# Altium project Host_CAP_sensor.PrjPcb
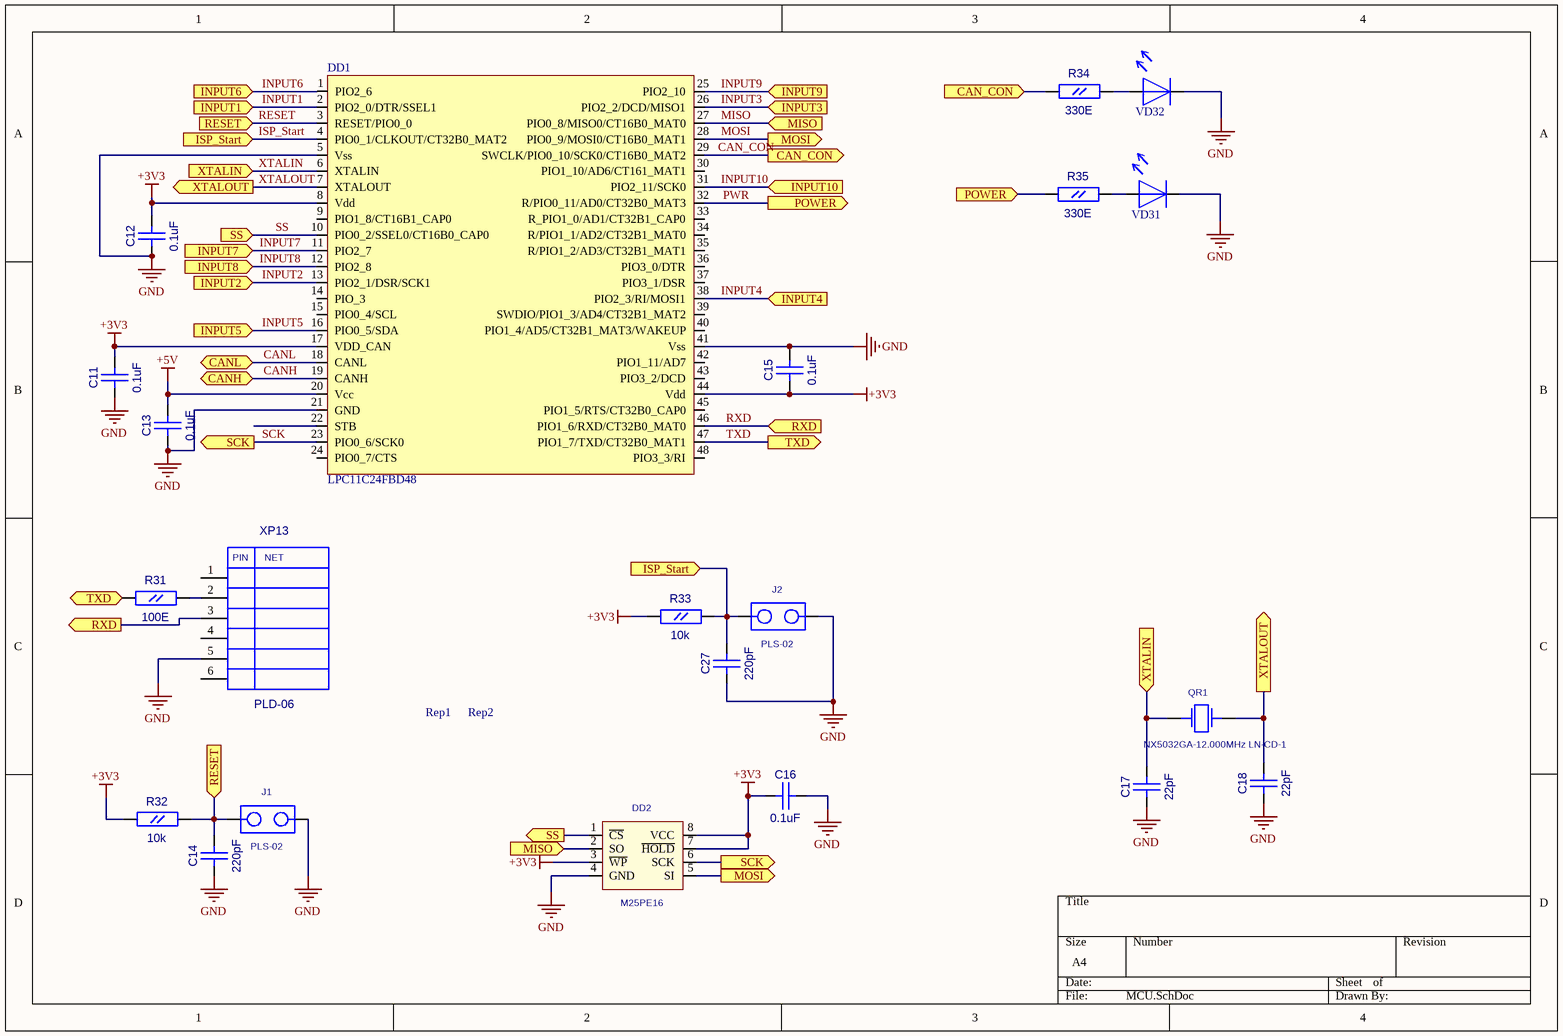
[diagram p0: MCU.SchDoc]
5 sheets, 162 parts. Net scope: flat (ports and power ports of the same name join across sheets).
Board file: cap_sensor_host.PcbDoc
Sheets:
  MCU.SchDoc
  Connectors.SchDoc
  LED_indication.SchDoc
  Power.SchDoc
  Input_scheme.SchDoc

## Sheet MCU.SchDoc
size A4

### Parts
(Parts that share a designator on the sheet are numbered #1, #2 ... from top to bottom, then left to right.)
C11  0.1uF  [CC0603]
C12  0.1uF  [CC0603]
C13  0.1uF  [CC0603]
C14  220pF  [CC0603]
C15  0.1uF  [CC0603]
C16  0.1uF  [CC0603]
C17  22pF  [CC0603]
C18  22pF  [CC0603]
C27  220pF  [CC0603]
DD1  LPC11C24FBD48  [LQFP-48]
DD2  M25PE16  [EIAJ_SO8]
J1  PLS-02  [PIN2W]
J2#1  PLS-02  [PIN2W]
QR1  NX5032GA-12.000MHz LN-CD-1  [AC5032_2]
R31  100E  [RC0603]
R32  10k  [RC0603]
R33  10k  [RC0603]
R34  330E  [RC0603]
R35  330E  [RC0603]
Rep1  REPER1.2  [REPER1.2]  (value not drawn)
Rep2  REPER1.2  [REPER1.2]  (value not drawn)
VD31  BL-HS135A-TRB  [LED0805]  (value not drawn)
VD32  BL-HG035A-TRB  [LED0805]  (value not drawn)
XP13  PLD-06  [PIN6]

### Ports
CAN_CON (in), CAN_CON (out), CANH, CANL, INPUT1 (in), INPUT2 (in), INPUT3 (in), INPUT4 (in), INPUT5 (in), INPUT6 (in), INPUT7 (in), INPUT8 (in), INPUT9 (in), INPUT10 (in), ISP_Start (in), MISO (in), MOSI (out), POWER (in), POWER (out), RESET (in), RXD (in), RXD (out), SCK (out), SS (in), SS (out), TXD (in), TXD (out), XTALIN (in), XTALOUT (out)

### Nets
+3V3: C11.2(B) C12.2(B) C15.1(A) C16.1(A) DD1.8(Vdd) DD1.17(VDD_CAN) DD1.44(Vdd) DD2.3(~{WP}) DD2.7(~{HOLD}) DD2.8(VCC) R32.1(A) R33.1(A)
+5V: C13.2(B) DD1.20(Vcc)
GND: C11.1(A) C12.1(A) C13.1(A) C14.1(A) C15.2(B) C16.2(B) C17.1(A) C18.1(A) C27.1(A) DD1.5(Vss) DD1.21(GND) DD1.41(Vss) DD2.4(GND) J1.2 J2#1.2 VD31.2 VD32.2 XP13.5
CAN_CON: DD1.29(SWCLK/PIO0_10/SCK0/CT16B0_MAT2) R34.1(A) ; port CAN_CON
CANH: DD1.19(CANH) ; port CANH
CANL: DD1.18(CANL) ; port CANL
INPUT1: DD1.2(PIO2_0/DTR/SSEL1) ; port INPUT1
INPUT2: DD1.13(PIO2_1/DSR/SCK1) ; port INPUT2
INPUT3: DD1.26(PIO2_2/DCD/MISO1) ; port INPUT3
INPUT4: DD1.38(PIO2_3/RI/MOSI1) ; port INPUT4
INPUT5: DD1.16(PIO0_5/SDA) ; port INPUT5
INPUT6: DD1.1(PIO2_6) ; port INPUT6
INPUT7: DD1.11(PIO2_7) ; port INPUT7
INPUT8: DD1.12(PIO2_8) ; port INPUT8
INPUT9: DD1.25(PIO2_10) ; port INPUT9
INPUT10: DD1.31(PIO2_11/SCK0) ; port INPUT10
ISP_Start: C27.2(B) DD1.4(PIO0_1/CLKOUT/CT32B0_MAT2) J2#1.1 R33.2(B) ; port ISP_Start
MISO: DD1.27(PIO0_8/MISO0/CT16B0_MAT0) DD2.2(SO) ; port MISO
MOSI: DD1.28(PIO0_9/MOSI0/CT16B0_MAT1) DD2.5(SI) ; port MOSI
PWR: DD1.32(R/PIO0_11/AD0/CT32B0_MAT3) R35.1(A) ; port POWER
RESET: C14.2(B) DD1.3(RESET/PIO0_0) J1.1 R32.2(B) ; port RESET
RXD: DD1.46(PIO1_6/RXD/CT32B0_MAT0) XP13.3 ; port RXD
SCK: DD1.23(PIO0_6/SCK0) DD2.6(SCK) ; port SCK
SS: DD1.10(PIO0_2/SSEL0/CT16B0_CAP0) DD2.1(~{CS}) ; port SS
TXD: DD1.47(PIO1_7/TXD/CT32B0_MAT1) R31.1(A) ; port TXD
XTALIN: C17.2(B) DD1.6(XTALIN) QR1.1 ; port XTALIN
XTALOUT: C18.2(B) DD1.7(XTALOUT) QR1.2 ; port XTALOUT
NetR31_2: R31.2(B) XP13.2
NetR34_2: R34.2(B) VD32.1
NetR35_2: R35.2(B) VD31.1

Not connected (* = marked no-connect by the designer): DD1 9(PIO1_8/CT16B1_CAP0) 14(PIO_3) 15(PIO0_4/SCL) 22(STB) 24(PIO0_7/CTS) 30(PIO1_10/AD6/CT161_MAT1) 33(R_PIO1_0/AD1/CT32B1_CAP0) 34(R/PIO1_1/AD2/CT32B1_MAT0) 35(R/PIO1_2/AD3/CT32B1_MAT1) 36(PIO3_0/DTR) 37(PIO3_1/DSR) 39(SWDIO/PIO1_3/AD4/CT32B1_MAT2) 40(PIO1_4/AD5/CT32B1_MAT3/WAKEUP) 42(PIO1_11/AD7) 43(PIO3_2/DCD) 45(PIO1_5/RTS/CT32B0_CAP0) 48(PIO3_3/RI); Rep1 1; Rep2 1; XP13 1 4 6

### Notes on the sheet
- (in symbol PLD-06) PIN; NET

### Library data of the parts
C11-C18 C27 = CC0603
  C11-C13 C15 C16: Value: 0.1uF
  C14 C27: Value: 220pF
  C17 C18: Value: 22pF
DD2 = S25FL016A0LMFI01: Value: M25PE16
QR1 = AC5032_2: AC5032/2; Value: NX5032GA-12.000MHz LN-CD-1
R31-R35 = RC0603
  R31: Value: 100E
  R32 R33: Value: 10k
  R34 R35: Value: 330E
VD31 VD32 = LED_0805
  VD31: Value: BL-HS135A-TRB
  VD32: Value: BL-HG035A-TRB
XP13 = PLD-06: PLD06; Value: *
DD1 = LPC11C24FBD48: Value: LPC11C24FBD48
J1 J2#1 = PLS-02: Value: *
Rep1 Rep2 = REPER1.2: Value: *

## Sheet Connectors.SchDoc
size A4
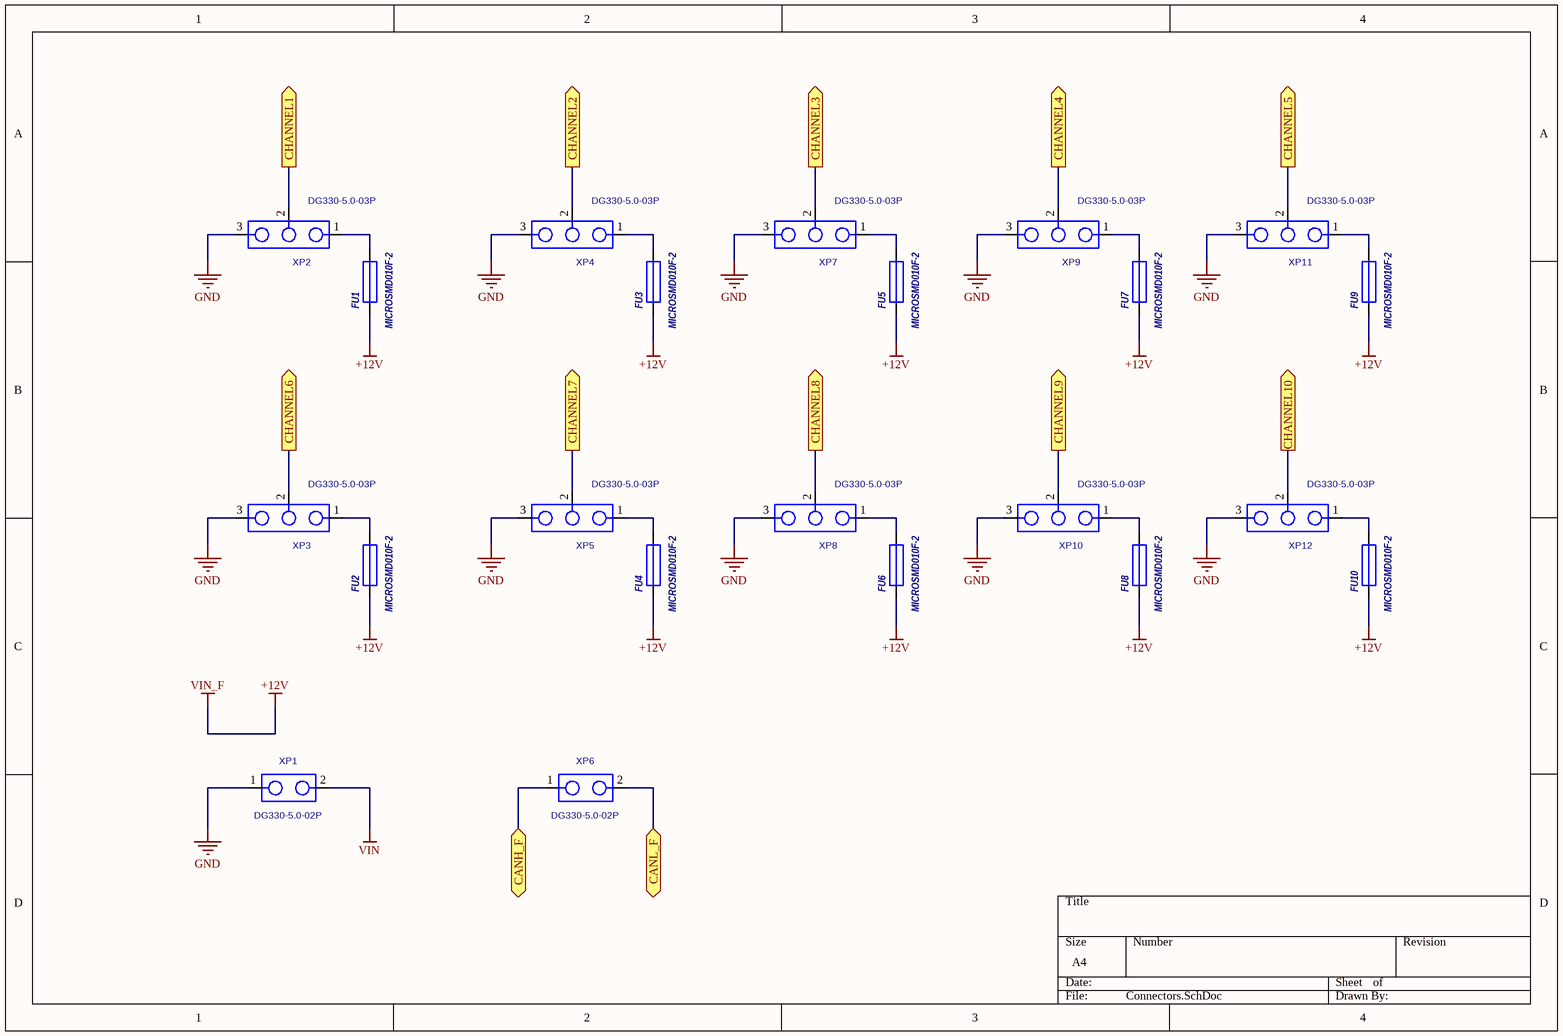
[diagram p1: Connectors.SchDoc]

### Parts
FU1  MICROSMD010F-2  [RC1210]
FU2  MICROSMD010F-2  [RC1210]
FU3  MICROSMD010F-2  [RC1210]
FU4  MICROSMD010F-2  [RC1210]
FU5  MICROSMD010F-2  [RC1210]
FU6  MICROSMD010F-2  [RC1210]
FU7  MICROSMD010F-2  [RC1210]
FU8  MICROSMD010F-2  [RC1210]
FU9  MICROSMD010F-2  [RC1210]
FU10  MICROSMD010F-2  [RC1210]
XP1  DG330-5.0-02P  [330-021]
XP2  DG330-5.0-03P  [DG330-5.0-03P]
XP3  DG330-5.0-03P  [DG330-5.0-03P]
XP4  DG330-5.0-03P  [DG330-5.0-03P]
XP5  DG330-5.0-03P  [DG330-5.0-03P]
XP6  DG330-5.0-02P  [330-021]
XP7  DG330-5.0-03P  [DG330-5.0-03P]
XP8  DG330-5.0-03P  [DG330-5.0-03P]
XP9  DG330-5.0-03P  [DG330-5.0-03P]
XP10  DG330-5.0-03P  [DG330-5.0-03P]
XP11  DG330-5.0-03P  [DG330-5.0-03P]
XP12  DG330-5.0-03P  [DG330-5.0-03P]

### Ports
CANH_F (bidir), CANL_F (bidir), CHANNEL1 (out), CHANNEL2 (out), CHANNEL3 (out), CHANNEL4 (out), CHANNEL5 (out), CHANNEL6 (out), CHANNEL7 (out), CHANNEL8 (out), CHANNEL9 (out), CHANNEL10 (out)

### Nets
+12V: FU1.1 FU2.1 FU3.1 FU4.1 FU5.1 FU6.1 FU7.1 FU8.1 FU9.1 FU10.1  [also labelled VIN_F]
GND: XP1.1 XP2.3 XP3.3 XP4.3 XP5.3 XP7.3 XP8.3 XP9.3 XP10.3 XP11.3 XP12.3
VIN: XP1.2
NetFU1_2: FU1.2 XP2.1
NetFU2_2: FU2.2 XP3.1
NetFU3_2: FU3.2 XP4.1
NetFU4_2: FU4.2 XP5.1
NetFU5_2: FU5.2 XP7.1
NetFU6_2: FU6.2 XP8.1
NetFU7_2: FU7.2 XP9.1
NetFU8_2: FU8.2 XP10.1
NetFU9_2: FU9.2 XP11.1
NetFU10_2: FU10.2 XP12.1
NetFU11_1: XP2.2 ; port CHANNEL1
NetFU12_1: XP4.2 ; port CHANNEL2
NetFU13_1: XP7.2 ; port CHANNEL3
NetFU14_1: XP9.2 ; port CHANNEL4
NetFU15_1: XP11.2 ; port CHANNEL5
NetFU16_1: XP3.2 ; port CHANNEL6
NetFU17_1: XP5.2 ; port CHANNEL7
NetFU18_1: XP8.2 ; port CHANNEL8
NetFU19_1: XP10.2 ; port CHANNEL9
NetFU20_1: XP12.2 ; port CHANNEL10
NetFU21_2: XP6.1 ; port CANH_F
NetFU22_2: XP6.2 ; port CANL_F

### Library data of the parts
FU1-FU10 = MICROSMD: Value: MICROSMD010F-2
XP1 XP6 = DG330-5.0-02P: Value: *
XP2-XP5 XP7-XP12 = DG330-5.0-03P: Value: DG330-5.0-03P

## Sheet LED_indication.SchDoc
size A4
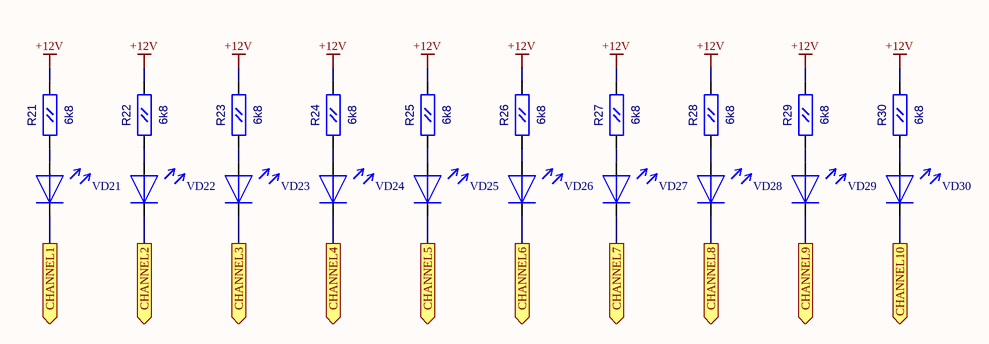
[diagram p2: LED_indication.SchDoc]

### Parts
R21  6k8  [RC0603]
R22  6k8  [RC0603]
R23  6k8  [RC0603]
R24  6k8  [RC0603]
R25  6k8  [RC0603]
R26  6k8  [RC0603]
R27  6k8  [RC0603]
R28  6k8  [RC0603]
R29  6k8  [RC0603]
R30  6k8  [RC0603]
VD21  BL-HS135A-TRB  [LED0805]  (value not drawn)
VD22  BL-HS135A-TRB  [LED0805]  (value not drawn)
VD23  BL-HS135A-TRB  [LED0805]  (value not drawn)
VD24  BL-HS135A-TRB  [LED0805]  (value not drawn)
VD25  BL-HS135A-TRB  [LED0805]  (value not drawn)
VD26  BL-HS135A-TRB  [LED0805]  (value not drawn)
VD27  BL-HS135A-TRB  [LED0805]  (value not drawn)
VD28  BL-HS135A-TRB  [LED0805]  (value not drawn)
VD29  BL-HS135A-TRB  [LED0805]  (value not drawn)
VD30  BL-HS135A-TRB  [LED0805]  (value not drawn)

### Ports
CHANNEL1 (out), CHANNEL2 (out), CHANNEL3 (out), CHANNEL4 (out), CHANNEL5 (out), CHANNEL6 (out), CHANNEL7 (out), CHANNEL8 (out), CHANNEL9 (out), CHANNEL10 (out)

### Nets
+12V: R21.2(B) R22.2(B) R23.2(B) R24.2(B) R25.2(B) R26.2(B) R27.2(B) R28.2(B) R29.2(B) R30.2(B)
NetFU11_1: VD21.2 ; port CHANNEL1
NetFU12_1: VD22.2 ; port CHANNEL2
NetFU13_1: VD23.2 ; port CHANNEL3
NetFU14_1: VD24.2 ; port CHANNEL4
NetFU15_1: VD25.2 ; port CHANNEL5
NetFU16_1: VD26.2 ; port CHANNEL6
NetFU17_1: VD27.2 ; port CHANNEL7
NetFU18_1: VD28.2 ; port CHANNEL8
NetFU19_1: VD29.2 ; port CHANNEL9
NetFU20_1: VD30.2 ; port CHANNEL10
NetR21_1: R21.1(A) VD21.1
NetR22_1: R22.1(A) VD22.1
NetR23_1: R23.1(A) VD23.1
NetR24_1: R24.1(A) VD24.1
NetR25_1: R25.1(A) VD25.1
NetR26_1: R26.1(A) VD26.1
NetR27_1: R27.1(A) VD27.1
NetR28_1: R28.1(A) VD28.1
NetR29_1: R29.1(A) VD29.1
NetR30_1: R30.1(A) VD30.1

### Library data of the parts
R21-R30 = RC0603: Value: 6k8
VD21-VD30 = LED_0805: Value: BL-HS135A-TRB

## Sheet Power.SchDoc
size A4
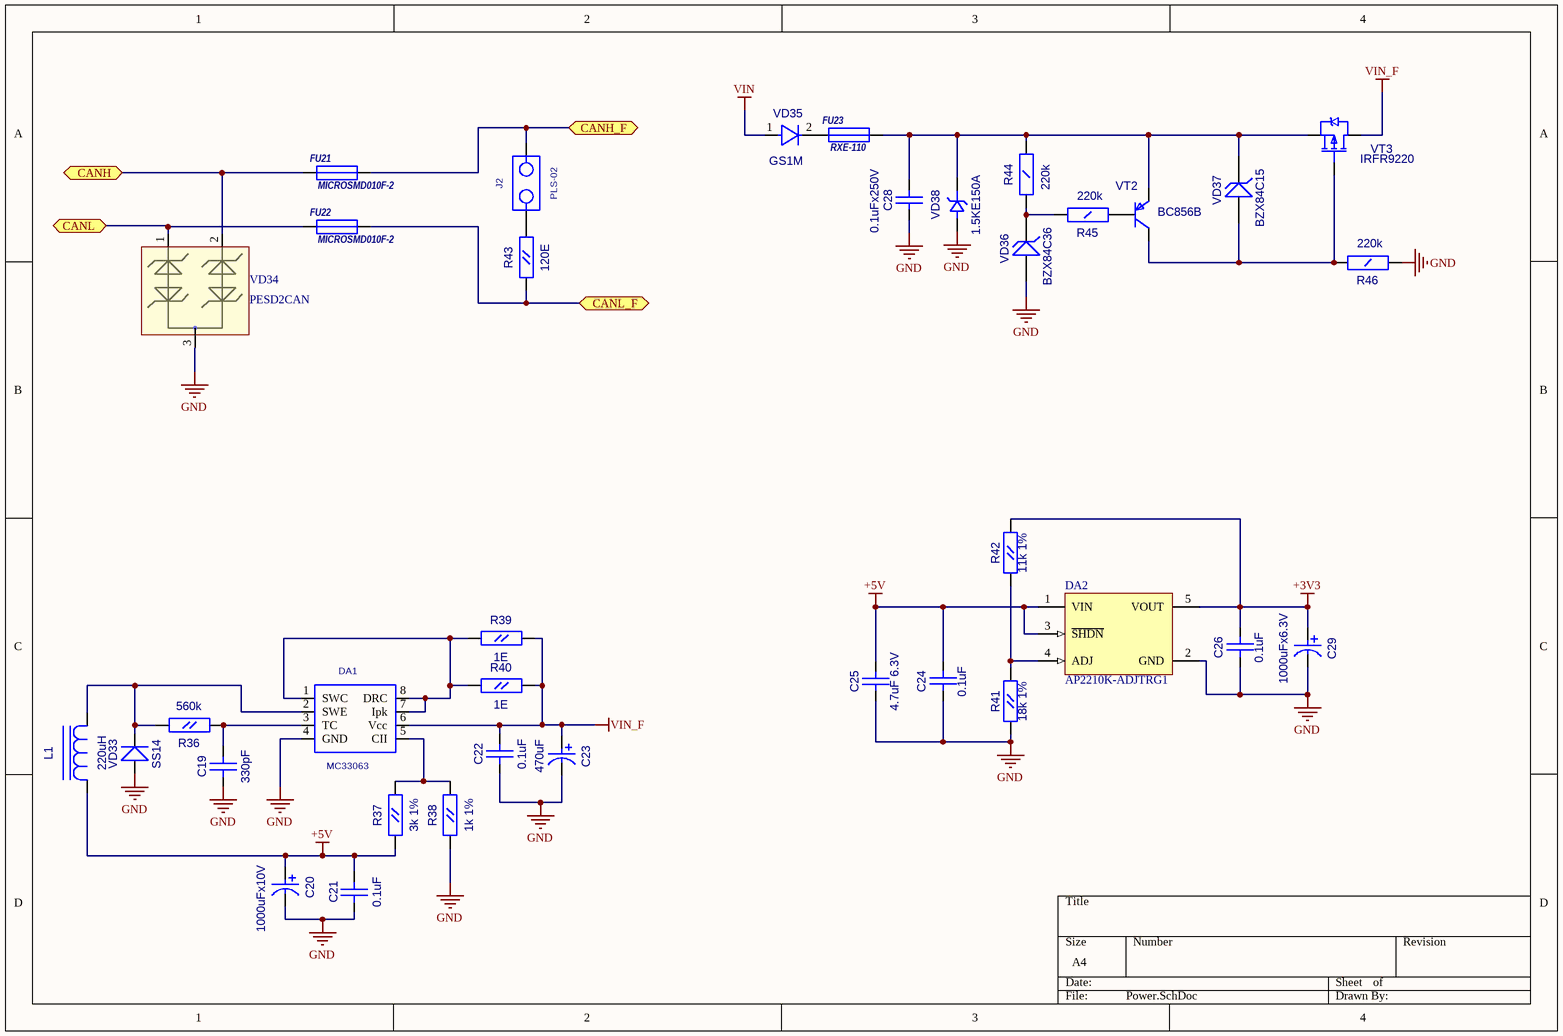
[diagram p3: Power.SchDoc]

### Parts
(Parts that share a designator on the sheet are numbered #1, #2 ... from top to bottom, then left to right.)
C19  330pF  [CC0603]
C20  1000uFx10V  [CC8X3.5]
C21  0.1uF  [CC0603]
C22  0.1uF  [CC0603]
C23  470uF  [CC16X10_CAP0.5(1)(Primary)]
C24  0.1uF  [CC0603]
C25  4.7uF 6.3V  [CC0805]
C26  0.1uF  [CC0603]
C28  0.1uFx250V  [CC1206]
C29  1000uFx6.3V  [CC8X3.5]
DA1  MC33063  [SO-8]
DA2  AP2210K-ADJTRG1  [SOT23-5]
FU21  MICROSMD010F-2  [RC1210]
FU22  MICROSMD010F-2  [RC1210]
FU23  RXE-110  [RXE-110]
J2#2  PLS-02  [PIN2W]
L1  220uH  [SDR0805]
R36  560k  [RC0603]
R37  3k 1%  [RC0603]
R38  1k 1%  [RC0603]
R39  1E  [RC0805]
R40  1E  [RC0805]
R41  18k 1%  [RC0603]
R42  11k 1%  [RC0603]
R43  120E  [RC0805]
R44  220k  [RC1206]
R45  220k  [RC1206]
R46  220k  [RC1206]
VD33  SS14  [SMA]
VD34  PESD2CAN  [SOT-23(123)]
VD35  GS1M  [SMA]
VD36  BZX84C36  [SOT-23(123)]
VD37  BZX84C15  [SOT-23(123)]
VD38  1.5KE150A  [DO-201]
VT2  BC856B  [SOT-23(123)]
VT3  IRFR9220  [D-PAK(TO-252AA)]

### Ports
CANH (bidir), CANH_F (bidir), CANL (bidir), CANL_F (bidir)

### Nets
+3V3: C26.1(A) C29.1 DA2.5(VOUT) R42.2(B)
+5V: C20.1 C21.2(B) C24.1(A) C25.2(B) DA2.1(VIN) DA2.3(~{SHDN}) L1.1(C) R37.1(A)
GND: C19.1(A) C20.2 C21.1(A) C22.1(A) C23.1 C24.2(B) C25.1(A) C26.2(B) C28.1(A) C29.2 DA1.4(GND) DA2.2(GND) R38.1(A) R41.1(A) R46.1(A) VD33.1(A) VD34.3 VD36.1(A) VD38.1(A)
VIN: VD35.1(A)
VIN_F: C22.2(B) C23.2 DA1.6(Vcc) R39.2(B) R40.2(B) VT3.3(D)  [project net +12V]
CANH: FU21.1 VD34.2 ; port CANH
CANL: FU22.1 VD34.1 ; port CANL
NetC19_2: C19.2(B) DA1.3(TC) R36.1(A)
NetC28_2: C28.2(B) FU23.2 R44.2(B) VD37.3(K) VD38.2(K) VT2.2(E) VT3.2(S)
NetDA1_1: DA1.1(SWC) DA1.7(Ipk) DA1.8(DRC) R39.1(A) R40.1(A)
NetDA1_2: DA1.2(SWE) L1.2(A) R36.2(B) VD33.2(K)
NetDA1_5: DA1.5(CII) R37.2(B) R38.2(B)
NetDA2_4: DA2.4(ADJ) R41.2(B) R42.1(A)
NetFU21_2: FU21.2 J2#2.2 ; port CANH_F
NetFU22_2: FU22.2 R43.1(A) ; port CANL_F
NetFU23_1: FU23.1 VD35.2(K)
NetJ2#2_1: J2#2.1 R43.2(B)
NetR44_1: R44.1(A) R45.2(B) VD36.3(K)
NetR45_1: R45.1(A) VT2.1(B)
NetR46_2: R46.2(B) VD37.1(A) VT2.3(C) VT3.1(G)

### Library data of the parts
C19 C21 C22 C24 C26 = CC0603
  C19: Value: 330pF
  C21 C22 C24 C26: Value: 0.1uF
C20 C29 = CAP0.35
  C20: Value: 1000uFx10V
  C29: Value: 1000uFx6.3V
C23 = CAP0.5(1): Value: 470uF
C25 = CC0805: Value: 4.7uF 6.3V
C28 = CC1206: Value: 0.1uFx250V
DA1 = MC34063: Value: MC33063
DA2 = MCP1824T-ADJE/OT: 300 mA, Low Voltage, Low Quiescent Current LDO Regulator, 5-Pin SOT-223, Extended Temperature, Tape and Reel; Published: 29-Jan-2009; DatasheetVersion: revA, Aug-2007; PackageVersion: revAW, Oct-2008; PackageReference: SOT-223-DC5; Publisher: Altium Limited; PackageDescription: 5-Lead Plastic Small Outline Transistor (DC) [SOT-223]; ComponentLink1Description: Manufacturer Link; ComponentLink1URL: http://www.microchip.com; ComponentLink2Description: Datasheet; ComponentLink2URL: http://ww1.microchip.com/downloads/en/DeviceDoc/22070a.pdf; ComponentLink3Description: Packaging Specification; ComponentLink3URL: http://ww1.microchip.com/downloads/en/PackagingSpec/00049AW.pdf
FU21 FU22 = MICROSMD: Value: MICROSMD010F-2
L1 = SDR0805: Value: 220uH
R36-R38 R41 R42 = RC0603
  R36: Value: 560k
  R37: Value: 3k 1%
  R38: Value: 1k 1%
  R41: Value: 18k 1%
  R42: Value: 11k 1%
R39 R40 R43 = RC0805
  R39 R40: Value: 1E
  R43: Value: 120E
R44-R46 = RC1206: Value: 220k
VD33 = SS14: Schottky Rectifier; Value: SS14
VD34 = PESD2CAN: TVS for CAN
VD35 = GS1M: Value: {Value}
VD36 VD37 = BZX84: Zener Voltage Regulator Diode
  VD36: Value: BZX84C36
  VD37: Value: BZX84C15
VD38 = 1.5KE: Value: 1.5KE150A
VT2 = BC856B: OriginalName: BC856BLT; ComponentField7: Published 29-Sep-2000; Value: BC856B
VT3 = IRFR9220: HEXFET Power MOSFET; OriginalName: IRLML5103; ComponentField7: Published 8-Jun-2000; Value: IRFR9220
FU23 = RXE-110: Value: *
J2#2 = PLS-02: Value: *

## Sheet Input_scheme.SchDoc
size A4
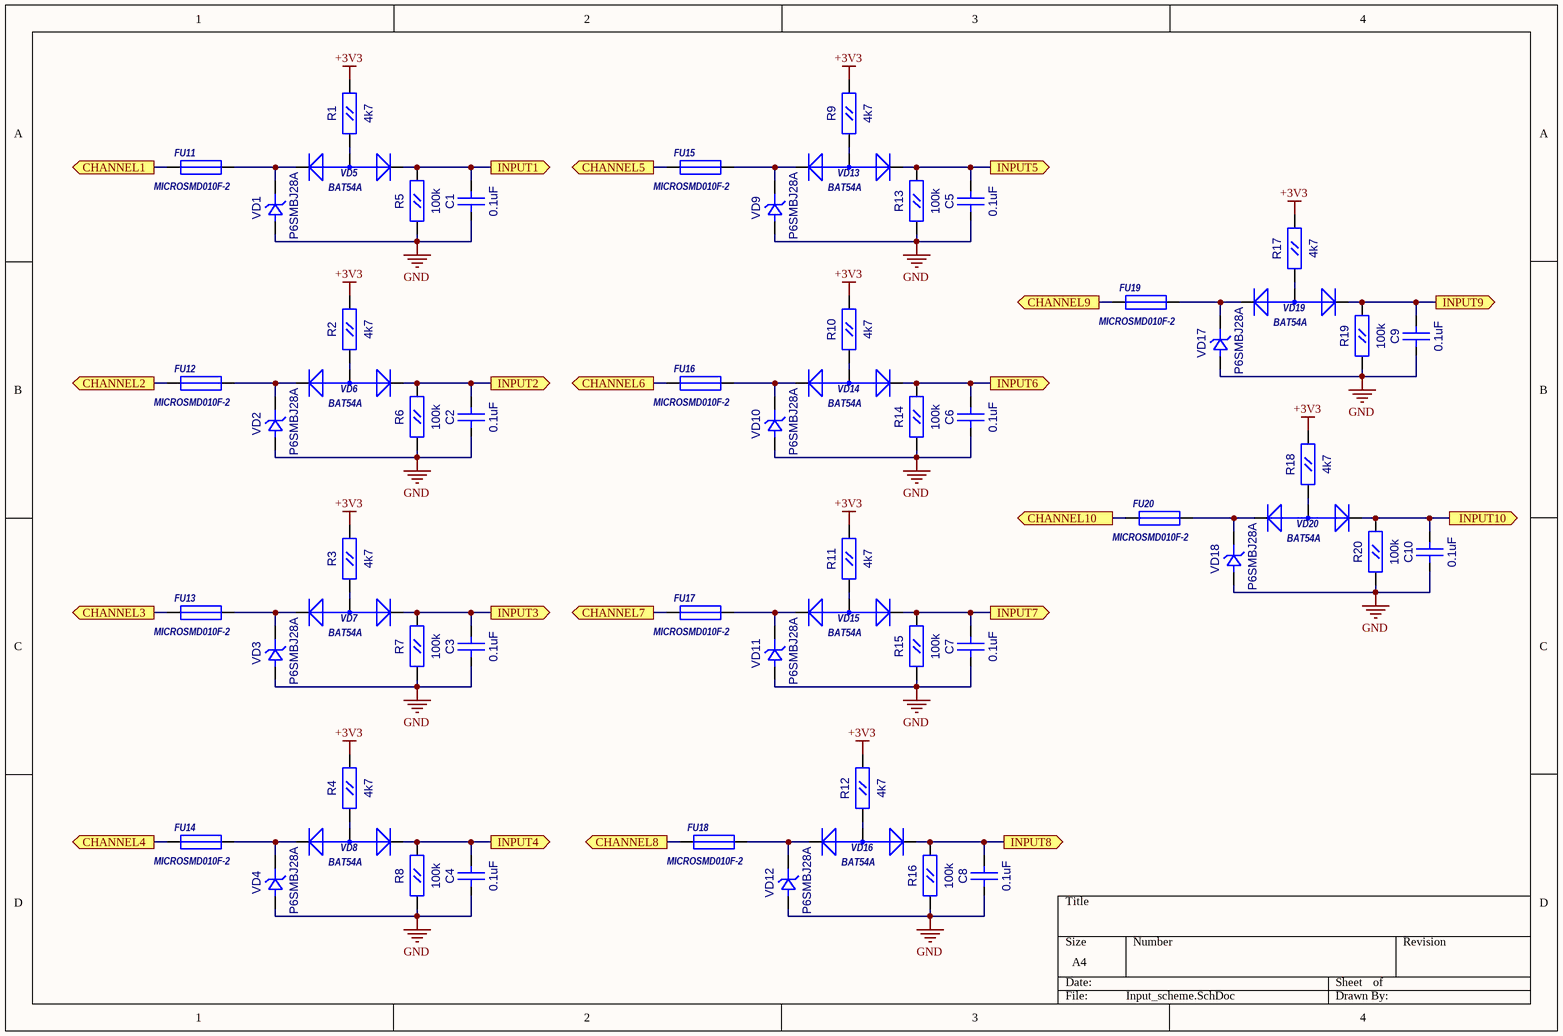
[diagram p4: Input_scheme.SchDoc]

### Parts
C1  0.1uF  [CC0603]
C2  0.1uF  [CC0603]
C3  0.1uF  [CC0603]
C4  0.1uF  [CC0603]
C5  0.1uF  [CC0603]
C6  0.1uF  [CC0603]
C7  0.1uF  [CC0603]
C8  0.1uF  [CC0603]
C9  0.1uF  [CC0603]
C10  0.1uF  [CC0603]
FU11  MICROSMD010F-2  [RC1210]
FU12  MICROSMD010F-2  [RC1210]
FU13  MICROSMD010F-2  [RC1210]
FU14  MICROSMD010F-2  [RC1210]
FU15  MICROSMD010F-2  [RC1210]
FU16  MICROSMD010F-2  [RC1210]
FU17  MICROSMD010F-2  [RC1210]
FU18  MICROSMD010F-2  [RC1210]
FU19  MICROSMD010F-2  [RC1210]
FU20  MICROSMD010F-2  [RC1210]
R1  4k7  [RC0603]
R2  4k7  [RC0603]
R3  4k7  [RC0603]
R4  4k7  [RC0603]
R5  100k  [RC0603]
R6  100k  [RC0603]
R7  100k  [RC0603]
R8  100k  [RC0603]
R9  4k7  [RC0603]
R10  4k7  [RC0603]
R11  4k7  [RC0603]
R12  4k7  [RC0603]
R13  100k  [RC0603]
R14  100k  [RC0603]
R15  100k  [RC0603]
R16  100k  [RC0603]
R17  4k7  [RC0603]
R18  4k7  [RC0603]
R19  100k  [RC0603]
R20  100k  [RC0603]
VD1  P6SMBJ28A  [SMB]
VD2  P6SMBJ28A  [SMB]
VD3  P6SMBJ28A  [SMB]
VD4  P6SMBJ28A  [SMB]
VD5  BAT54A  [SOT-23(123)]
VD6  BAT54A  [SOT-23(123)]
VD7  BAT54A  [SOT-23(123)]
VD8  BAT54A  [SOT-23(123)]
VD9  P6SMBJ28A  [SMB]
VD10  P6SMBJ28A  [SMB]
VD11  P6SMBJ28A  [SMB]
VD12  P6SMBJ28A  [SMB]
VD13  BAT54A  [SOT-23(123)]
VD14  BAT54A  [SOT-23(123)]
VD15  BAT54A  [SOT-23(123)]
VD16  BAT54A  [SOT-23(123)]
VD17  P6SMBJ28A  [SMB]
VD18  P6SMBJ28A  [SMB]
VD19  BAT54A  [SOT-23(123)]
VD20  BAT54A  [SOT-23(123)]

### Ports
CHANNEL1 (out), CHANNEL2 (out), CHANNEL3 (out), CHANNEL4 (out), CHANNEL5 (out), CHANNEL6 (out), CHANNEL7 (out), CHANNEL8 (out), CHANNEL9 (out), CHANNEL10 (out), INPUT1 (out), INPUT2 (out), INPUT3 (out), INPUT4 (out), INPUT5 (out), INPUT6 (out), INPUT7 (out), INPUT8 (out), INPUT9 (out), INPUT10 (out)

### Nets
+3V3: R1.2(B) R2.2(B) R3.2(B) R4.2(B) R9.2(B) R10.2(B) R11.2(B) R12.2(B) R17.2(B) R18.2(B)
GND: C1.1(A) C2.1(A) C3.1(A) C4.1(A) C5.1(A) C6.1(A) C7.1(A) C8.1(A) C9.1(A) C10.1(A) R5.1(A) R6.1(A) R7.1(A) R8.1(A) R13.1(A) R14.1(A) R15.1(A) R16.1(A) R19.1(A) R20.1(A) VD1.1(A) VD2.1(A) VD3.1(A) VD4.1(A) VD9.1(A) VD10.1(A) VD11.1(A) VD12.1(A) VD17.1(A) VD18.1(A)
INPUT1: C1.2(B) R5.2(B) VD5.2(K) ; port INPUT1
INPUT2: C2.2(B) R6.2(B) VD6.2(K) ; port INPUT2
INPUT3: C3.2(B) R7.2(B) VD7.2(K) ; port INPUT3
INPUT4: C4.2(B) R8.2(B) VD8.2(K) ; port INPUT4
INPUT5: C5.2(B) R13.2(B) VD13.2(K) ; port INPUT5
INPUT6: C6.2(B) R14.2(B) VD14.2(K) ; port INPUT6
INPUT7: C7.2(B) R15.2(B) VD15.2(K) ; port INPUT7
INPUT8: C8.2(B) R16.2(B) VD16.2(K) ; port INPUT8
INPUT9: C9.2(B) R19.2(B) VD19.2(K) ; port INPUT9
INPUT10: C10.2(B) R20.2(B) VD20.2(K) ; port INPUT10
NetFU11_1: FU11.1 ; port CHANNEL1
NetFU11_2: FU11.2 VD1.2(K) VD5.1(K)
NetFU12_1: FU12.1 ; port CHANNEL2
NetFU12_2: FU12.2 VD2.2(K) VD6.1(K)
NetFU13_1: FU13.1 ; port CHANNEL3
NetFU13_2: FU13.2 VD3.2(K) VD7.1(K)
NetFU14_1: FU14.1 ; port CHANNEL4
NetFU14_2: FU14.2 VD4.2(K) VD8.1(K)
NetFU15_1: FU15.1 ; port CHANNEL5
NetFU15_2: FU15.2 VD9.2(K) VD13.1(K)
NetFU16_1: FU16.1 ; port CHANNEL6
NetFU16_2: FU16.2 VD10.2(K) VD14.1(K)
NetFU17_1: FU17.1 ; port CHANNEL7
NetFU17_2: FU17.2 VD11.2(K) VD15.1(K)
NetFU18_1: FU18.1 ; port CHANNEL8
NetFU18_2: FU18.2 VD12.2(K) VD16.1(K)
NetFU19_1: FU19.1 ; port CHANNEL9
NetFU19_2: FU19.2 VD17.2(K) VD19.1(K)
NetFU20_1: FU20.1 ; port CHANNEL10
NetFU20_2: FU20.2 VD18.2(K) VD20.1(K)
NetR1_1: R1.1(A) VD5.3(A)
NetR2_1: R2.1(A) VD6.3(A)
NetR3_1: R3.1(A) VD7.3(A)
NetR4_1: R4.1(A) VD8.3(A)
NetR9_1: R9.1(A) VD13.3(A)
NetR10_1: R10.1(A) VD14.3(A)
NetR11_1: R11.1(A) VD15.3(A)
NetR12_1: R12.1(A) VD16.3(A)
NetR17_1: R17.1(A) VD19.3(A)
NetR18_1: R18.1(A) VD20.3(A)

### Library data of the parts
C1-C10 = CC0603: Value: 0.1uF
FU11-FU20 = MICROSMD: Value: MICROSMD010F-2
R1-R20 = RC0603
  R1-R4 R9-R12 R17 R18: Value: 4k7
  R5-R8 R13-R16 R19 R20: Value: 100k
VD1-VD4 VD9-VD12 VD17 VD18 = SMBJ: Value: P6SMBJ28A
VD5-VD8 VD13-VD16 VD19 VD20 = BAT54A: ComponentField6: Published 8-Jun-2000, Modified 11-July-2000: SIM Model Added.; Value: *

## Nets that join several sheets
+3V3: MCU (12 pins), Power (C26.1 C29.1 DA2.5 R42.2), Input_scheme (10 pins)
+5V: MCU (C13.2 DD1.20), Power (8 pins)
+12V: Connectors (10 pins), LED_indication (10 pins), Power (6 pins)
GND: MCU (18 pins), Connectors (11 pins), Power (19 pins), Input_scheme (30 pins)
VIN: Connectors (XP1.2), Power (VD35.1)
CANH: MCU (DD1.19), Power (FU21.1 VD34.2)
CANL: MCU (DD1.18), Power (FU22.1 VD34.1)
INPUT1: MCU (DD1.2), Input_scheme (C1.2 R5.2 VD5.2)
INPUT2: MCU (DD1.13), Input_scheme (C2.2 R6.2 VD6.2)
INPUT3: MCU (DD1.26), Input_scheme (C3.2 R7.2 VD7.2)
INPUT4: MCU (DD1.38), Input_scheme (C4.2 R8.2 VD8.2)
INPUT5: MCU (DD1.16), Input_scheme (C5.2 R13.2 VD13.2)
INPUT6: MCU (DD1.1), Input_scheme (C6.2 R14.2 VD14.2)
INPUT7: MCU (DD1.11), Input_scheme (C7.2 R15.2 VD15.2)
INPUT8: MCU (DD1.12), Input_scheme (C8.2 R16.2 VD16.2)
INPUT9: MCU (DD1.25), Input_scheme (C9.2 R19.2 VD19.2)
INPUT10: MCU (DD1.31), Input_scheme (C10.2 R20.2 VD20.2)
NetFU11_1: Connectors (XP2.2), LED_indication (VD21.2), Input_scheme (FU11.1)
NetFU12_1: Connectors (XP4.2), LED_indication (VD22.2), Input_scheme (FU12.1)
NetFU13_1: Connectors (XP7.2), LED_indication (VD23.2), Input_scheme (FU13.1)
NetFU14_1: Connectors (XP9.2), LED_indication (VD24.2), Input_scheme (FU14.1)
NetFU15_1: Connectors (XP11.2), LED_indication (VD25.2), Input_scheme (FU15.1)
NetFU16_1: Connectors (XP3.2), LED_indication (VD26.2), Input_scheme (FU16.1)
NetFU17_1: Connectors (XP5.2), LED_indication (VD27.2), Input_scheme (FU17.1)
NetFU18_1: Connectors (XP8.2), LED_indication (VD28.2), Input_scheme (FU18.1)
NetFU19_1: Connectors (XP10.2), LED_indication (VD29.2), Input_scheme (FU19.1)
NetFU20_1: Connectors (XP12.2), LED_indication (VD30.2), Input_scheme (FU20.1)
NetFU21_2: Connectors (XP6.1), Power (FU21.2 J2#2.2)
NetFU22_2: Connectors (XP6.2), Power (FU22.2 R43.1)